# EAGLE schematic untitled (EAGLE 9.6.2)
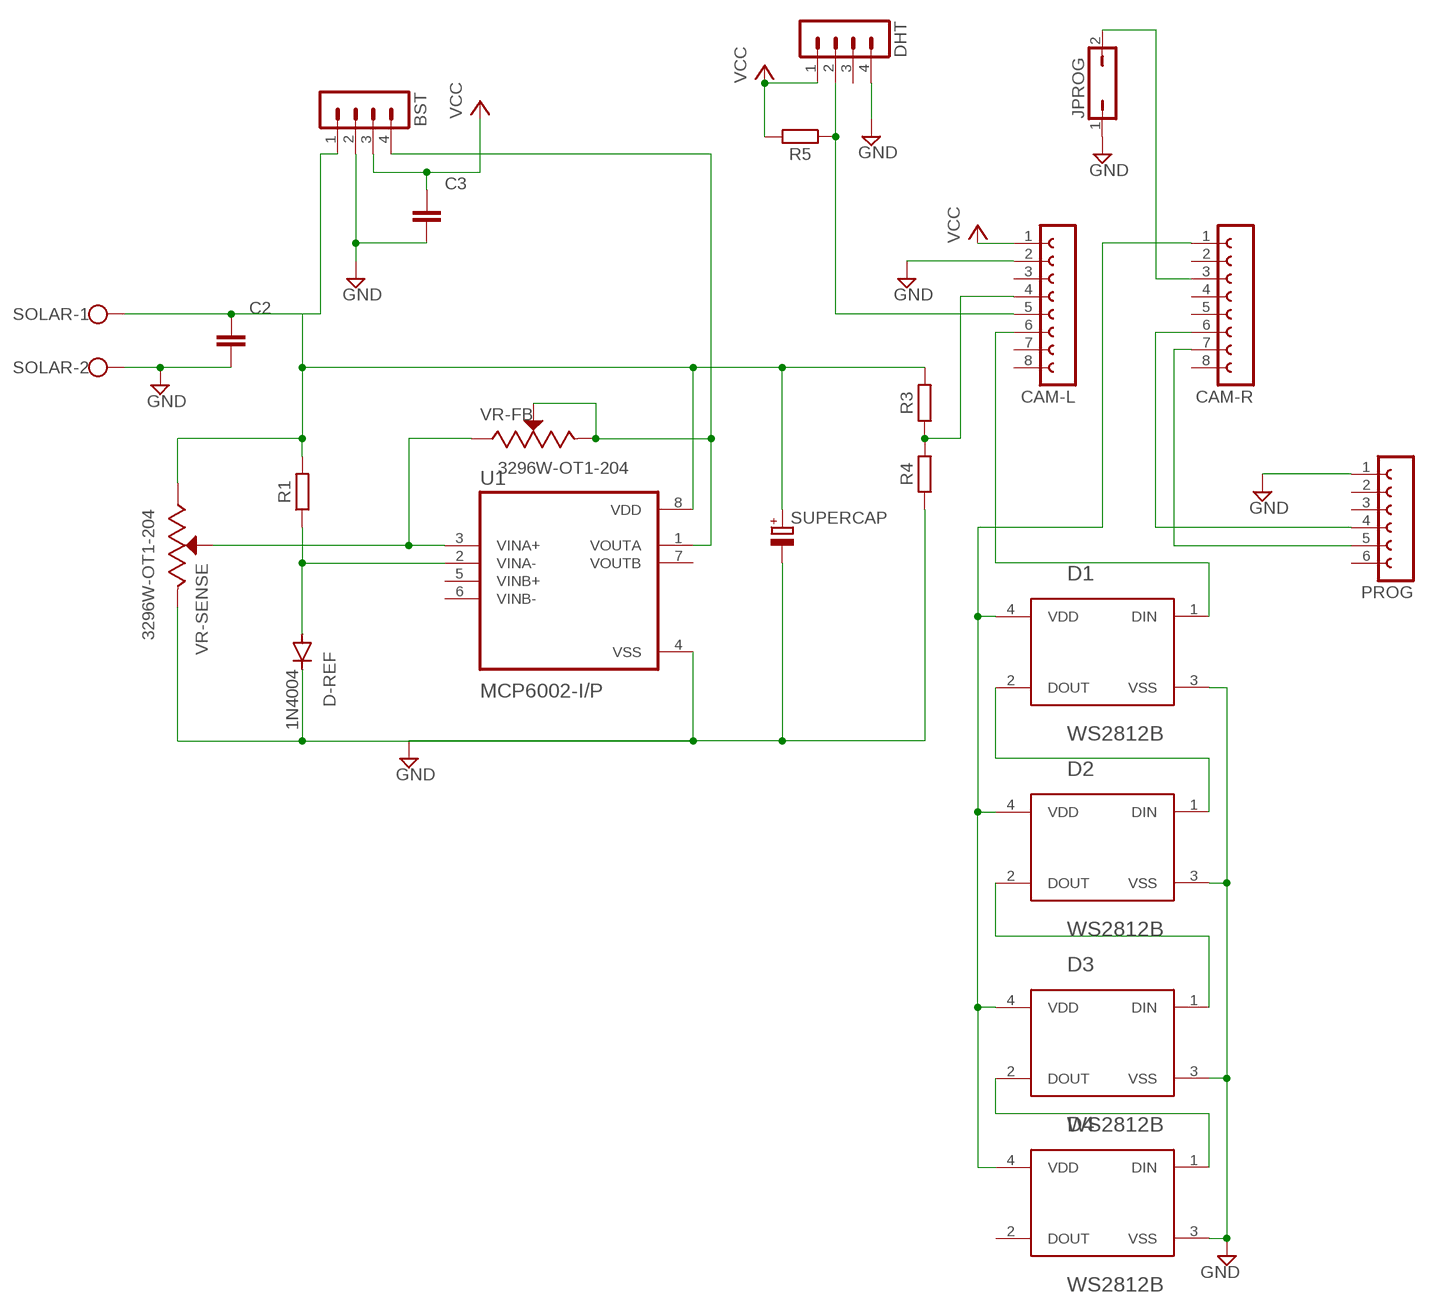
[diagram p0: schematic, sheet 1]

## Parts
BST  MA04-1  [MA04-1]
C2  C_RADIAL-12.5MM-DIA  [CAPRD550W60D1025H1250B]
C3  C_RADIAL-12.5MM-DIA  [CAPRD550W60D1025H1250B]
CAM-L  FE08-1  [FE08]
CAM-R  FE08-1  [FE08]
D1  WS2812B  [5050]
D2  WS2812B  [5050]
D3  WS2812B  [5050]
D4  WS2812B  [5050]
D-REF  1N4004  [DO41-10]
DHT  MA04-1  [MA04-1]
JPROG  JP1Q  [JP1]
PROG  FE06-1  [FE06]
R1  R_AXIAL-7.2MM-PITCH  [RESAD724W46L381D178B]
R3  R_AXIAL-7.2MM-PITCH  [RESAD724W46L381D178B]
R4  R_AXIAL-7.2MM-PITCH  [RESAD724W46L381D178B]
R5  R_AXIAL-7.2MM-PITCH  [RESAD724W46L381D178B]
SOLAR  W237-102  [W237-102]
SUPERCAP  C-POL_RADIAL-32MM-DIA  [CAPPRD1000W100D2275H3200B]
U1  MCP6002-I/P  [DIP787W46P254L927H533Q8]
VR-FB  3296W-OT1-204  [TRIM_3296W-OT1-204]
VR-SENSE  3296W-OT1-204  [TRIM_3296W-OT1-204]

## Nets
GND: BST.2 C2.2 C3.2 CAM-L.2 D1.3(VSS) D2.3(VSS) D3.3(VSS) D4.3(VSS) D-REF.C DHT.4 JPROG.1 PROG.1 R4.1 SOLAR.2 SUPERCAP.2(-) U1.4(VSS) VR-SENSE.3(CW)
N$1: D-REF.A R1.1 U1.2(VINA-)
N$2: D3.2(DOUT) D4.1(DIN)
N$3: BST.4 U1.1(VOUTA) VR-FB.2(WIPER) VR-FB.3(CW)
N$4: BST.1 C2.1 R1.2 R3.2 SOLAR.1 SUPERCAP.1(+) U1.8(VDD) VR-SENSE.1(CCW)
N$5: U1.3(VINA+) VR-FB.1(CCW) VR-SENSE.2(WIPER)
N$6: CAM-L.4 R3.1 R4.2
N$7: CAM-R.7 PROG.5
N$8: CAM-R.6 PROG.4
N$9: CAM-L.5 DHT.2 R5.1
N$10: CAM-R.3 JPROG.2
N$11: CAM-R.1 D1.4(VDD) D2.4(VDD) D3.4(VDD) D4.4(VDD)
N$13: D1.2(DOUT) D2.1(DIN)
N$14: D2.2(DOUT) D3.1(DIN)
N$15: CAM-L.6 D1.1(DIN)
VCC: BST.3 C3.1 CAM-L.1 DHT.1 R5.2
Unconnected: CAM-L.3 CAM-L.7 CAM-L.8 CAM-R.2 CAM-R.4 CAM-R.5 CAM-R.8 D4.2(DOUT) DHT.3 PROG.2 PROG.3 PROG.6 U1.5(VINB+) U1.6(VINB-) U1.7(VOUTB)

## Library data of the parts
BST DHT = con-lstb:MA04-1: PIN HEADER; OC_FARNELL: unknown; OC_NEWARK: unknown
C2 C3 = Capacitor:C: Capacitor - Generic; CATEGORY: Capacitor
CAM-L CAM-R = con-lsta:FE08-1: FEMALE HEADER; OC_FARNELL: unknown; OC_NEWARK: unknown
D1-D4 = WS2812B:WS2812B; AVAILABILITY: Unavailable; DESCRIPTION: WS2812B 5050 RGB LED with Integrated Driver Chip - 10 Pack; MF: Adafruit Industries; MP: ADA1655; PACKAGE: 5050 Worldsemi; PRICE: None
D-REF = diode:1N4004: DIODE general purpose rectifier, 1 A
JPROG = jumper:JP1Q: JUMPER
PROG = con-lsta:FE06-1: FEMALE HEADER; OC_FARNELL: unknown; OC_NEWARK: unknown
R1 R3-R5 = Resistor:R: Resistor Fixed - Generic; CATEGORY: Resistor; SUB-CATEGORY: Fixed
SOLAR = con-wago-500:W237-102: WAGO SCREW CLAMP; MPN: 237-102; OC_FARNELL: unknown; OC_NEWARK: 70K9898
SUPERCAP = Capacitor:C-POL: Capacitor Polarised - Generic; CATEGORY: Capacitor
U1 = MCP6002-I_P:MCP6002-I/P: Check prices <https://pricing.snapeda.com/parts/MCP6002-I/P/Microchip/view-part?ref=eda>; AVAILABILITY: Good; DESCRIPTION: General Purpose Amplifier 2 Circuit Rail-to-Rail 8-PDIP; MF: Microchip; MP: MCP6002-I/P; PACKAGE: DIP-8 Microchip; PRICE: None; PURCHASE-URL: https://pricing.snapeda.com/search/part/MCP6002-I/P/?ref=eda
VR-FB VR-SENSE = 3296W-OT1-204:3296W-OT1-204: Res Cermet Trimmer 500K Ohm 10% 0.5W 25(Elec)Turn 2.19mm (9.53 X 4.83 X 11.55mm) Pin Thru-Hole Tube Check prices <https://pricing.snapeda.com/parts/3296W-OT1-204/Bourns/view-part?ref=eda>; AVAILABILITY: Bad; DESCRIPTION: Potentiometers, multi, Resistors, trimmer, cermet, potentiometers, turn, sealed, Potentiometers and Accessories, Pass...; MF: Bourns; MP: 3296W-OT1-204; PACKAGE: None; PRICE: None

## Net classes
0 default: width 0.762 mm, clearance 0.762 mm